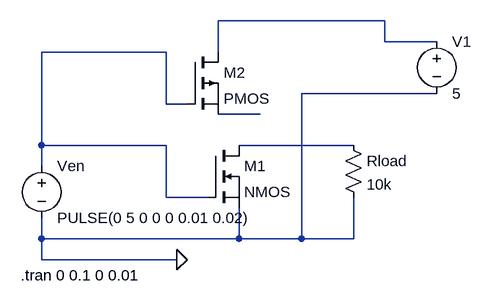
[diagram p0: schematic CMOS_Inverter.asc]
CMOS_Inverter.asc, the LTspice schematic file:
Version 4
SHEET 1 880 680
WIRE 544 -112 288 -112
WIRE 544 -80 544 -112
WIRE 624 -80 544 -80
WIRE 208 -64 16 -64
WIRE 288 -64 288 -112
WIRE 624 0 416 0
WIRE 208 16 208 -64
WIRE 240 16 208 16
WIRE 352 32 288 32
WIRE 16 80 16 -64
WIRE 208 80 16 80
WIRE 496 80 320 80
WIRE 16 112 16 80
WIRE 208 160 208 80
WIRE 272 160 208 160
WIRE 16 224 16 192
WIRE 320 224 320 176
WIRE 320 224 16 224
WIRE 416 224 416 0
WIRE 416 224 320 224
WIRE 496 224 496 160
WIRE 496 224 416 224
WIRE 16 256 16 224
WIRE 224 256 16 256
FLAG 224 256 0
SYMBOL voltage 16 96 R0
WINDOW 123 0 0 Left 2
WINDOW 39 0 0 Left 2
SYMATTR InstName Ven
SYMATTR Value PULSE(0 5 0 0 0 0.01 0.02)
SYMBOL res 480 64 R0
SYMATTR InstName Rload
SYMATTR Value 10k
SYMBOL voltage 624 -96 R0
WINDOW 123 0 0 Left 2
WINDOW 39 0 0 Left 2
SYMATTR InstName V1
SYMATTR Value 5
SYMBOL nmos 272 80 R0
SYMATTR InstName M1
SYMBOL pmos 240 -64 R0
SYMATTR InstName M2
TEXT -16 280 Left 2 !.tran 0 0.1 0 0.01

The netlist it stands for:
* CMOS_Inverter.asc
Ven N002 0 PULSE(0 5 0 0 0 0.01 0.02)
Rload N004 0 10k
V1 N001 0 5
M1 N004 N002 0 0 NMOS
M2 N001 N002 N003 N003 PMOS
.model NMOS NMOS
.model PMOS PMOS
.lib standard.mos
.tran 0 0.1 0 0.01
.backanno
.end